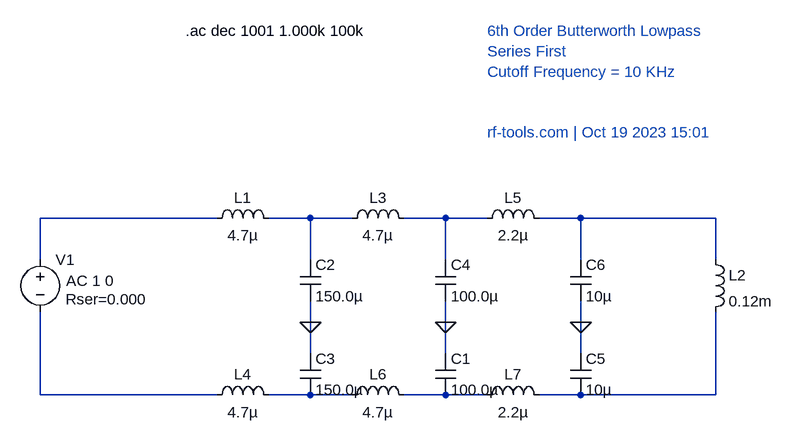
[diagram p0: schematic filter.asc]
filter.asc, the LTspice schematic file:
Version 4
SHEET 1 1200 400
WIRE 64 0 -208 0
WIRE 208 0 144 0
WIRE 272 0 208 0
WIRE 416 0 352 0
WIRE 480 0 416 0
WIRE 624 0 560 0
WIRE 832 0 624 0
WIRE -208 64 -208 0
WIRE 208 64 208 0
WIRE 416 64 416 0
WIRE 624 64 624 0
WIRE 832 64 832 0
WIRE 208 160 208 128
WIRE 416 160 416 128
WIRE 624 160 624 128
WIRE 208 208 208 160
WIRE 416 208 416 160
WIRE 624 208 624 160
WIRE -208 272 -208 144
WIRE 64 272 -208 272
WIRE 208 272 144 272
WIRE 272 272 208 272
WIRE 416 272 352 272
WIRE 480 272 416 272
WIRE 624 272 560 272
WIRE 832 272 832 144
WIRE 832 272 624 272
FLAG 208 160 0
FLAG 416 160 0
FLAG 624 160 0
SYMBOL voltage -208 48 R0
WINDOW 123 40 48 Left 2
WINDOW 39 39 77 Left 2
SYMATTR Value2 AC 1 0
SYMATTR SpiceLine Rser=0.000
SYMATTR InstName V1
SYMATTR Value ""
SYMBOL ind 48 16 R270
WINDOW 0 32 56 VTop 2
WINDOW 3 5 56 VBottom 2
SYMATTR InstName L1
SYMATTR Value 4.7µ
SYMBOL cap 192 64 R0
SYMATTR InstName C2
SYMATTR Value 150.0µ
SYMBOL ind 256 16 R270
WINDOW 0 32 56 VTop 2
WINDOW 3 5 56 VBottom 2
SYMATTR InstName L3
SYMATTR Value 4.7µ
SYMBOL cap 400 64 R0
SYMATTR InstName C4
SYMATTR Value 100.0µ
SYMBOL ind 464 16 R270
WINDOW 0 32 56 VTop 2
WINDOW 3 5 56 VBottom 2
SYMATTR InstName L5
SYMATTR Value 2.2µ
SYMBOL cap 608 64 R0
SYMATTR InstName C6
SYMATTR Value 10µ
SYMBOL cap 400 208 R0
SYMATTR InstName C1
SYMATTR Value 100.0µ
SYMBOL cap 192 208 R0
SYMATTR InstName C3
SYMATTR Value 150.0µ
SYMBOL cap 608 208 R0
SYMATTR InstName C5
SYMATTR Value 10µ
SYMBOL ind 816 48 R0
SYMATTR InstName L2
SYMATTR Value 0.12m
SYMATTR SpiceLine Rpar=0.2
SYMBOL ind 48 288 R270
WINDOW 0 32 56 VTop 2
WINDOW 3 5 56 VBottom 2
SYMATTR InstName L4
SYMATTR Value 4.7µ
SYMBOL ind 256 288 R270
WINDOW 0 32 56 VTop 2
WINDOW 3 5 56 VBottom 2
SYMATTR InstName L6
SYMATTR Value 4.7µ
SYMBOL ind 464 288 R270
WINDOW 0 32 56 VTop 2
WINDOW 3 5 56 VBottom 2
SYMATTR InstName L7
SYMATTR Value 2.2µ
TEXT 16 -288 Left 2 !.ac dec 1001 1.000k 100k
TEXT 480 -288 Left 2 ;6th Order Butterworth Lowpass\nSeries First\nCutoff Frequency = 10 KHz\n\n\nrf-tools.com | Oct 19 2023 15:01

The netlist it stands for:
* filter.asc
V1 N001 N005 AC 1 0 Rser=0.000
L1 N001 N002 4.7µ
C2 N002 0 150.0µ
L3 N002 N003 4.7µ
C4 N003 0 100.0µ
L5 N003 N004 2.2µ
C6 N004 0 10µ
C1 0 N007 100.0µ
C3 0 N006 150.0µ
C5 0 N008 10µ
L2 N004 N008 0.12m Rpar=0.2
L4 N005 N006 4.7µ
L6 N006 N007 4.7µ
L7 N007 N008 2.2µ
.ac dec 1001 1.000k 100k
* 6th Order Butterworth Lowpass
* Series First
* Cutoff Frequency = 10 KHz
* rf-tools.com | Oct 19 2023 15:01
.backanno
.end